# EAGLE design FeatherAzureSphere (EAGLE 8.0.2)
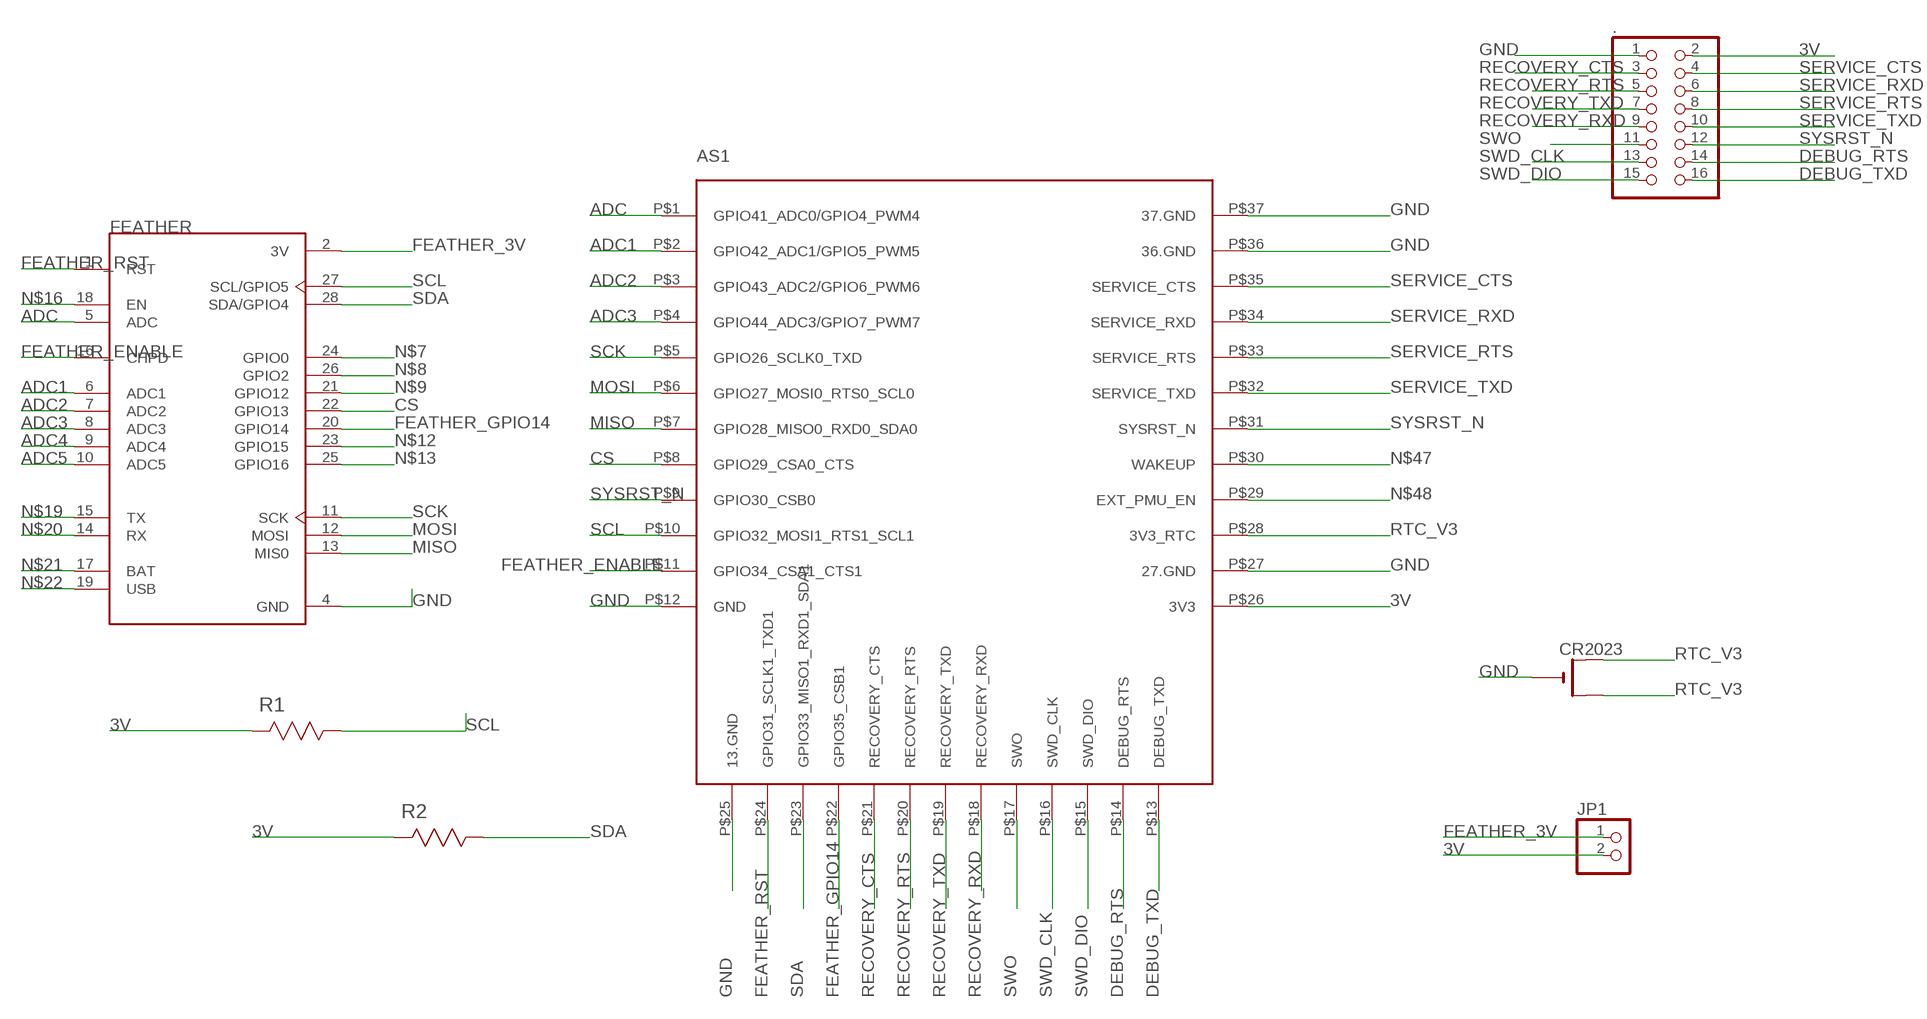
[diagram p0: schematic, sheet 1]

## Parts
.  PINHD-2X8  [2X08]
AS1  WF-M620-RSC1  [WF-M620-RSC1]
CR2023  CR2032SMT  [CR2032-SMD]
FEATHER  2821  [XCVR_2821]
JP1  PINHD-1X2  [1X02]
R1  ERJ-8RQF1R5V  [RESC3216X71N]
R2  ERJ-8RQF1R5V  [RESC3216X71N]

## Nets
3V: ..2 AS1.P$26(3V3) JP1.2 R1.2(R2) R2.2(R2)
ADC: AS1.P$1(GPIO41_ADC0/GPIO4_PWM4) FEATHER.5(ADC)
ADC1: AS1.P$2(GPIO42_ADC1/GPIO5_PWM5) FEATHER.6(ADC1)
ADC2: AS1.P$3(GPIO43_ADC2/GPIO6_PWM6) FEATHER.7(ADC2)
ADC3: AS1.P$4(GPIO44_ADC3/GPIO7_PWM7) FEATHER.8(ADC3)
ADC4: FEATHER.9(ADC4)
ADC5: FEATHER.10(ADC5)
CS: AS1.P$8(GPIO29_CSA0_CTS) FEATHER.22(GPIO13)
DEBUG_RTS: ..14 AS1.P$14(DEBUG_RTS)
DEBUG_TXD: ..16 AS1.P$13(DEBUG_TXD)
FEATHER_3V: FEATHER.2(3V) JP1.1
FEATHER_ENABLE: AS1.P$11(GPIO34_CSA1_CTS1) FEATHER.16(CHPD)
FEATHER_GPIO14: AS1.P$22(GPIO35_CSB1) FEATHER.20(GPIO14)
FEATHER_RST: AS1.P$24(GPIO31_SCLK1_TXD1) FEATHER.1(RST)
GND: ..1 AS1.P$12(GND) AS1.P$25(13.GND) AS1.P$27(27.GND) AS1.P$36(36.GND) AS1.P$37(37.GND) CR2023.- FEATHER.4(GND)
MISO: AS1.P$7(GPIO28_MISO0_RXD0_SDA0) FEATHER.13(MIS0)
MOSI: AS1.P$6(GPIO27_MOSI0_RTS0_SCL0) FEATHER.12(MOSI)
N$7: FEATHER.24(GPIO0)
N$8: FEATHER.26(GPIO2)
N$9: FEATHER.21(GPIO12)
N$12: FEATHER.23(GPIO15)
N$13: FEATHER.25(GPIO16)
N$16: FEATHER.18(EN)
N$19: FEATHER.15(TX)
N$20: FEATHER.14(RX)
N$21: FEATHER.17(BAT)
N$22: FEATHER.19(USB)
N$47: AS1.P$30(WAKEUP)
N$48: AS1.P$29(EXT_PMU_EN)
RECOVERY_CTS: ..3 AS1.P$21(RECOVERY_CTS)
RECOVERY_RTS: ..5 AS1.P$20(RECOVERY_RTS)
RECOVERY_RXD: ..9 AS1.P$18(RECOVERY_RXD)
RECOVERY_TXD: ..7 AS1.P$19(RECOVERY_TXD)
RTC_V3: AS1.P$28(3V3_RTC) CR2023.+$1(+) CR2023.+$2(+1)
SCK: AS1.P$5(GPIO26_SCLK0_TXD) FEATHER.11(SCK)
SCL: AS1.P$10(GPIO32_MOSI1_RTS1_SCL1) FEATHER.27(SCL/GPIO5) R1.1(R1)
SDA: AS1.P$23(GPIO33_MISO1_RXD1_SDA1) FEATHER.28(SDA/GPIO4) R2.1(R1)
SERVICE_CTS: ..4 AS1.P$35(SERVICE_CTS)
SERVICE_RTS: ..8 AS1.P$33(SERVICE_RTS)
SERVICE_RXD: ..6 AS1.P$34(SERVICE_RXD)
SERVICE_TXD: ..10 AS1.P$32(SERVICE_TXD)
SWD_CLK: ..13 AS1.P$16(SWD_CLK)
SWD_DIO: ..15 AS1.P$15(SWD_DIO)
SWO: ..11 AS1.P$17(SWO)
SYSRST_N: ..12 AS1.P$9(GPIO30_CSB0) AS1.P$31(SYSRST_N)

## Library data of the parts
. = pinhead:PINHD-2X8: PIN HEADER
AS1 = AzureSphere:WF-M620-RSC1
CR2023 = cr2032:CR2032
FEATHER = 2821:2821: Adafruit Feather HUZZAH with ESP8266 WiFi; AVAILABILITY: Unavailable; DESCRIPTION: Adafruit Feather HUZZAH with ESP8266 WiFi; MF: Adafruit Industries; MP: 2821; PACKAGE: None; PRICE: None
JP1 = pinhead:PINHD-1X2: PIN HEADER
R1 R2 = Panasonic_By_element14_Batch_1:ERJ-8RQF1R5V: RESISTOR, 1206; MPN: ERJ-8RQF1R5V; OC_FARNELL: 1717854; OC_NEWARK: 15R1531; SUPPLIER: Panasonic; TOLERANCE: ±1 %; VALUE: 1.5 Ohm; WATTAGE: 0.25 W

## Board
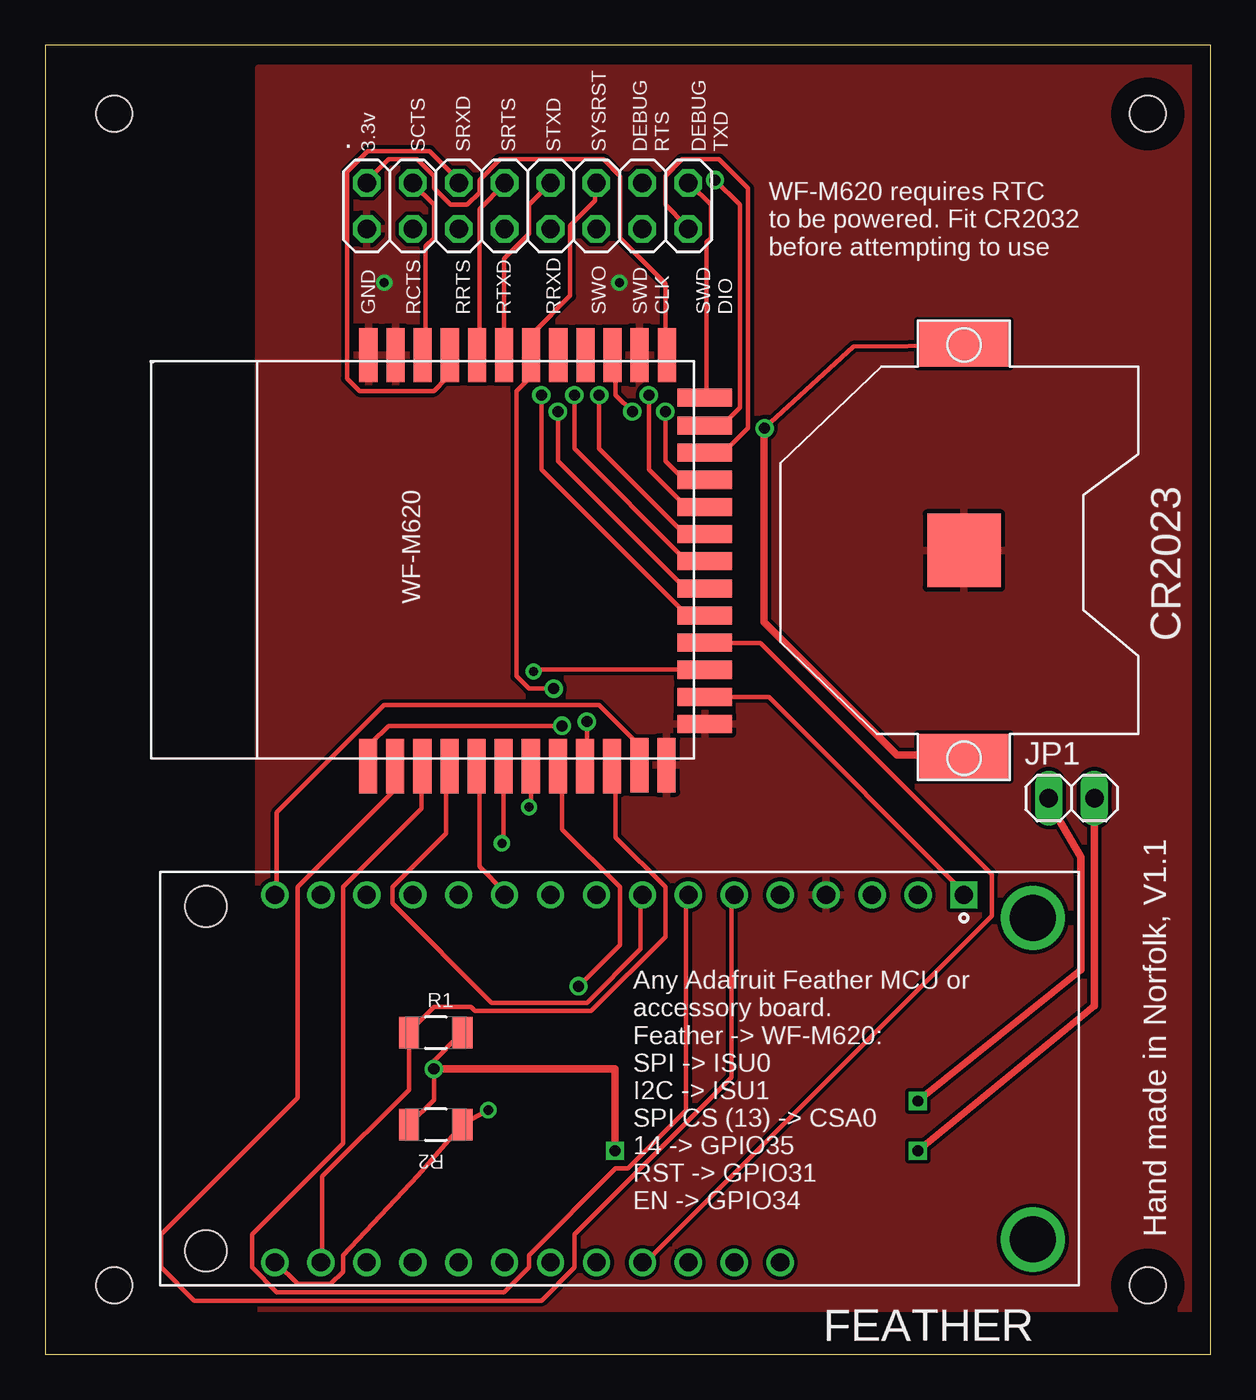
[diagram p1: board, top side]
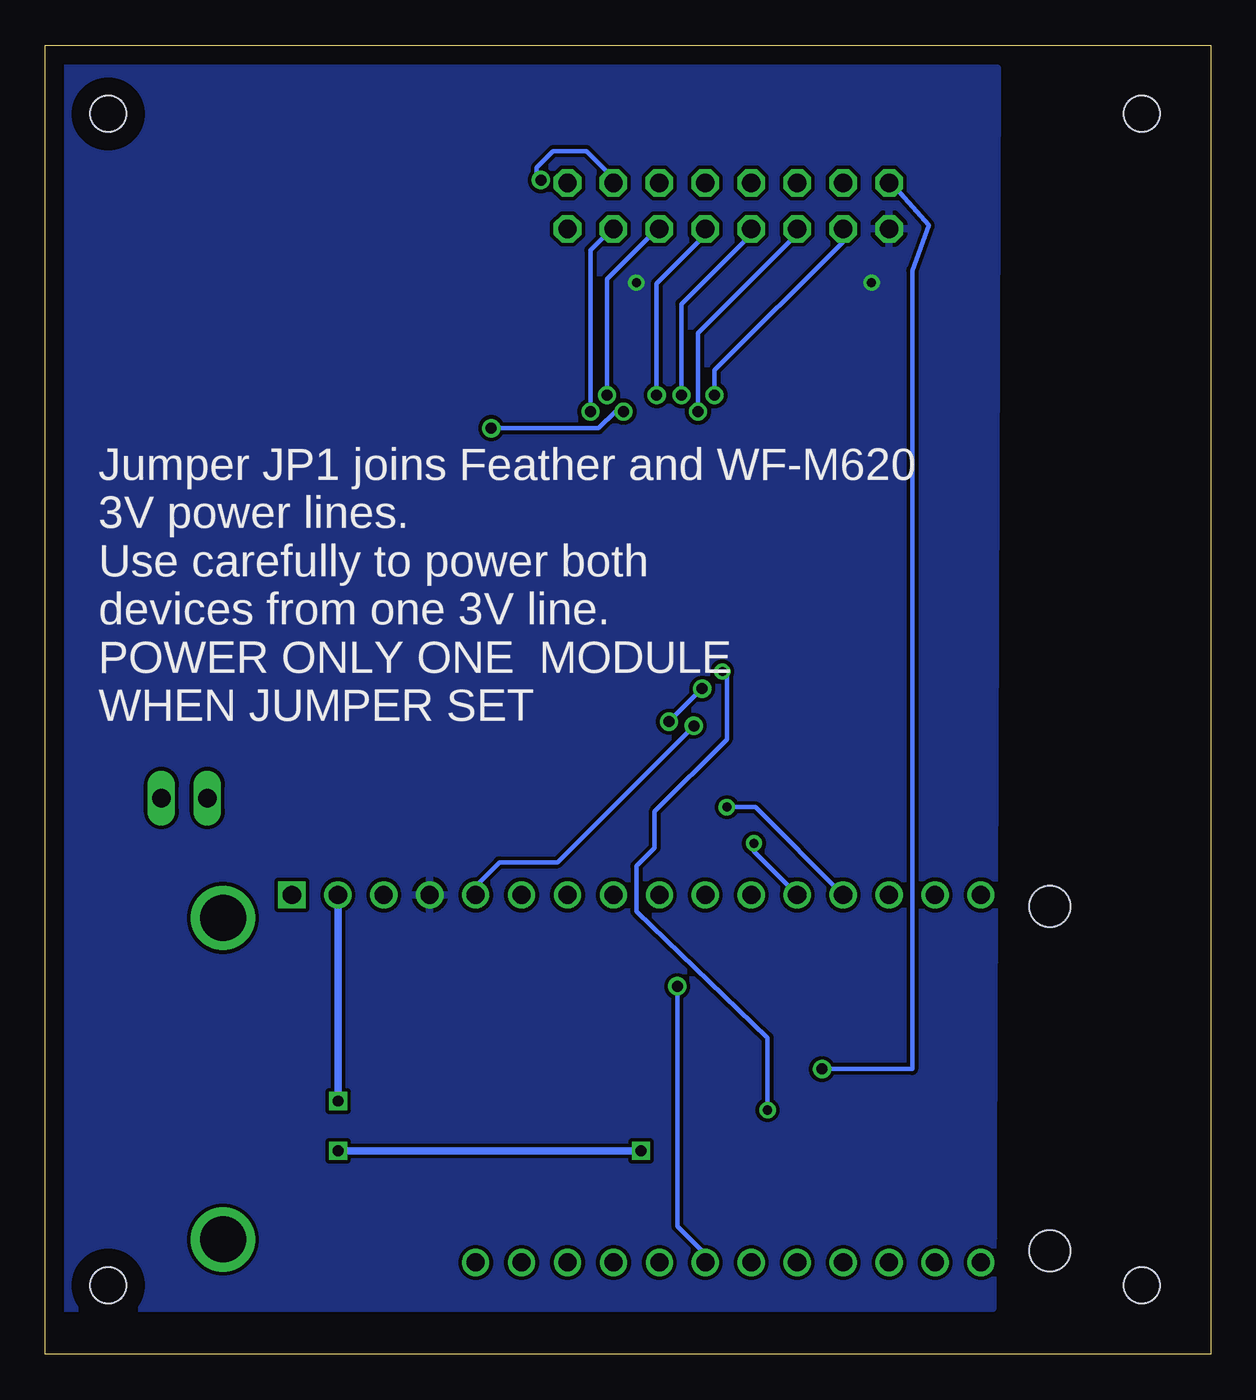
[diagram p2: board, bottom side, seen from below]

Size 64.44 x 72.38 mm. Coordinates in mm from the lower left corner, seen from the top.
Outline: 0,0 64.44,0 64.44,72.38 0,72.38 0,0
Copper layers (1*16): Top 0.035mm / dielectric 1.5mm / Bottom 0.035mm
Design rules "default": minimum track width 10mil, minimum drill 24mil, track to track 8mil, track to pad 8mil, pad to pad 8mil, via to via 8mil, smd to smd 8mil, copper to edge 40mil, drill to drill 8mil, minimum pad ring 10mil, minimum via ring 8mil, stop-mask expansion 4mil, vias tented up to drill 0mil, thermal gap 10mil
Holes 2 mm at 3.81,68.58 3.81,3.81 60.96,68.58 60.96,3.81

### Footprints (pad centres in the part's own frame; a part is rotated, then mirrored left to right if it is on the bottom)
2X08 = drill 1.016 octagon: 1 -8.89,-1.27; 2 -8.89,1.27; 3 -6.35,-1.27; 4 -6.35,1.27; 5 -3.81,-1.27; 6 -3.81,1.27; 7 -1.27,-1.27; 8 -1.27,1.27; 9 1.27,-1.27; 10 1.27,1.27; 11 3.81,-1.27; 12 3.81,1.27; 13 6.35,-1.27; 14 6.35,1.27; 15 8.89,-1.27; 16 8.89,1.27
WF-M620-RSC1 = smd 3 x 1: P$1 -11.93,-3.88; P$2 -11.93,-5.38; P$3 -11.93,-6.88; P$4 -11.93,-8.38; P$5 -11.93,-9.88; P$6 -11.93,-11.38; P$7 -11.93,-12.88; P$8 -11.93,-14.38; P$9 -11.93,-15.88; P$10 -11.93,-17.38; P$11 -11.88,-18.88; P$12 -11.88,-20.38; P$26 10.8,-20.4; P$27 10.8,-18.9; P$28 10.8,-17.4; P$29 10.8,-15.9; P$30 10.8,-14.4; P$31 10.8,-12.9; P$32 10.8,-11.4; P$33 10.8,-9.9; P$34 10.8,-8.4; P$35 10.8,-6.9; P$36 10.8,-5.4; P$37 10.8,-3.9 | smd 1 x 3: P$13 8.45,-22.5; P$14 6.9,-22.5; P$15 5.4,-22.5; P$16 3.9,-22.5; P$17 2.4,-22.5; P$18 0.9,-22.5; P$19 -0.6,-22.5; P$20 -2.1,-22.5; P$21 -3.6,-22.5; P$22 -5.1,-22.5; P$23 -6.6,-22.5; P$24 -8.1,-22.5; P$25 -9.6,-22.5
CR2032-SMD = smd 2.54 x 5.08: +$1 -11.43,0; +$2 11.43,0 | smd 4.064 x 4.064: - 0,0
XCVR_2821 = drill 1 square: 1 -19.05,-10.16 | drill 1: 2 -16.51,-10.16; 3 -13.97,-10.16; 4 -11.43,-10.16; 5 -8.89,-10.16; 6 -6.35,-10.16; 7 -3.81,-10.16; 8 -1.27,-10.16; 9 1.27,-10.16; 10 3.81,-10.16; 11 6.35,-10.16; 12 8.89,-10.16; 13 11.43,-10.16; 14 13.97,-10.16; 15 16.51,-10.16; 16 19.05,-10.16; 17 -8.89,10.16; 18 -6.35,10.16; 19 -3.81,10.16; 20 -1.27,10.16; 21 1.27,10.16; 22 3.81,10.16; 23 6.35,10.16; 24 8.89,10.16; 25 11.43,10.16; 26 13.97,10.16; 27 16.51,10.16; 28 19.05,10.16 | drill 2.54: S1 -22.86,-8.89; S2 -22.86,8.89 | hole 2.286: 22.86,-9.525; 22.86,9.525
1X02 = drill 1.016 long: 1 -1.27,0; 2 1.27,0
RESC3216X71N = smd 1.118 x 1.753: 1 -1.473,0; 2 1.473,0

### Placement (x,y rotation side)
.  26.67,63.5 0 top
AS1  13.97,44.45 90 top
CR2023  50.8,44.45 270 top
FEATHER  31.75,15.24 180 top
JP1  56.75,30.75 0 top
R1  21.59,17.78 0 top
R2  21.59,12.7 180 top

### Tracks (layer width: path | path; a pad name or v marks a point on that pad's centre or on a via)
3V  (via drill 0.6, 0.61)
  Top 0.254: R1.2 22.86,17.6 21.49,16.23 v21.49,15.77 21.49,14.07 R2.2 | AS1.P$26 34.29,55.32 34.29,59.21 31.77,61.72 31.77,65.15 30.86,66.06 25.15,66.06 24,64.92 24,64.24 23.32,63.55 22.4,63.55 21.49,64.47 21.49,65.15 20.57,66.06 18.97,66.06 17.83,64.92 ..2
  Top 0.406: v21.49,15.77 31.5,15.77 v31.5,11.25 | JP1.2 58.02,19.25 v48.25,11.25
  Bottom 0.254: v21.49,15.77 16.5,15.77 16.5,59.92 15.58,62.42 17.6,64.69 ..2
  Bottom 0.406: v31.5,11.25 v48.25,11.25
ADC  (via drill 0.61)
  Top 0.254: v28.57,34.75 18.97,34.75 18.06,33.83 18.06,32.69 AS1.P$1
  Bottom 0.254: v28.57,34.75 36.12,27.2 39.32,27.2 40.46,26.06 40.46,25.6 FEATHER.5
ADC1
  Top 0.254: AS1.P$2 19.2,32.46 19.2,31.09 13.95,25.83 13.95,14.17 6.4,6.63 6.4,4.8 8.23,2.97 27.43,2.97 29.26,4.8 29.26,6.63 37.95,15.32 37.95,25.38 FEATHER.6
ADC2
  Top 0.254: AS1.P$3 20.8,32.46 20.8,30.18 16.46,25.83 16.46,11.66 11.43,6.63 11.43,4.8 12.8,3.43 25.38,3.43 26.75,4.8 26.75,5.49 31.55,10.29 32.23,10.29 35.43,13.49 35.43,25.38 FEATHER.7
ADC3
  Top 0.254: AS1.P$4 22.17,32.46 22.17,28.8 19.2,25.83 19.2,24.92 24.69,19.43 29.95,19.43 32.92,22.4 32.92,25.38 FEATHER.8
CS  (via drill 0.61)
  Top 0.254: v29.49,20.34 31.77,22.63 31.77,25.83 28.57,29.03 28.57,32.46 AS1.P$8
  Bottom 0.254: v29.49,20.34 29.49,7.09 28.12,5.71 28.12,5.26 FEATHER.22
DEBUG_RTS  (via drill 0.61)
  Top 0.254: v37.03,64.92 38.41,63.55 38.41,52.35 37.49,51.44 36.58,51.44 AS1.P$14
  Bottom 0.254: v37.03,64.92 37.26,65.15 37.26,65.61 36.35,66.52 34.52,66.52 32.92,64.92 ..14
DEBUG_TXD
  Top 0.254: AS1.P$13 36.58,53.03 36.58,61.49 36.8,61.72 36.8,63.55 35.66,64.69 ..16
FEATHER_3V  (via drill 0.6)
  Top 0.254: JP1.1 55.55,30.63 55.48,30.5
  Top 0.406: 55.48,30.5 57.25,27.5 57.25,21.25 v48.25,14
  Bottom 0.406: FEATHER.2 v48.25,14
FEATHER_ENABLE
  Top 0.254: AS1.P$11 32.69,32.69 32.69,33.83 30.63,35.89 18.75,35.89 12.8,29.95 12.8,25.6 FEATHER.16
FEATHER_GPIO14
  Top 0.254: AS1.P$22 36.58,39.32 39.55,39.32 52.35,26.52 52.35,24.23 33.15,5.03 FEATHER.20
FEATHER_RST
  Top 0.254: AS1.P$24 36.58,36.35 40.01,36.35 50.75,25.6 FEATHER.1
GND  (via drill 0.5)
  other vias: 31.75,59.25 18.75,59.25
  pour Top: 11.79,71.12 63.5,71.12 63.5,2.54 11.79,2.54
  pour Bottom: 11.79,71.12 63.5,71.12 63.5,2.54 12.04,2.54
MISO  (via drill 0.5)
  Top 0.254: AS1.P$7 26.85,30.6 v26.75,30.25
  Bottom 0.254: v26.75,30.25 25.17,30.25 FEATHER.13
MOSI  (via drill 0.5)
  Top 0.254: AS1.P$6 25.35,28.35 v25.25,28.25
  Bottom 0.254: v25.25,28.25 25.25,27.79 FEATHER.12
RECOVERY_CTS  (via drill 0.61)
  Top 0.254: v27.43,53.03 27.43,48.92 35.43,40.92 36.35,40.92 AS1.P$21
  Bottom 0.254: v27.43,53.03 27.43,54.41 20.34,61.49 20.34,62.18 ..3
RECOVERY_RTS  (via drill 0.61)
  Top 0.254: v28.35,52.12 28.35,49.38 35.2,42.52 36.35,42.52 AS1.P$20
  Bottom 0.254: v28.35,52.12 28.35,56.46 22.86,61.95 ..5
RECOVERY_RXD  (via drill 0.61)
  Top 0.254: v30.63,53.03 30.63,50.06 35.2,45.49 36.35,45.49 AS1.P$18
  Bottom 0.254: v30.63,53.03 30.63,59.21 28.12,61.72 28.12,62.18 ..9
RECOVERY_TXD  (via drill 0.61)
  Top 0.254: v29.26,53.03 29.26,50.06 35.43,43.89 36.35,43.89 AS1.P$19
  Bottom 0.254: v29.26,53.03 29.26,58.06 25.6,61.72 25.6,62.18 ..7
RTC_V3  (via drill 0.61)
  Top 0.254: v32.46,52.12 31.55,53.03 31.55,55.09 AS1.P$28 | v39.78,51.21 44.68,55.71 50.75,55.78 CR2023.+$1 | CR2023.+$2 50.75,33.15
  Top 0.406: 50.75,33.15 47.1,33.15 39.75,40.5 39.75,51.21 v39.78,51.21
  Bottom 0.254: v32.46,52.12 32.92,52.12 33.83,51.21 v39.78,51.21
SCK
  Top 0.254: AS1.P$5 24,32.46 24,26.98 25.38,25.6 FEATHER.11
SCL
  Top 0.254: FEATHER.27 15.32,5.26 15.32,9.83 20.12,14.63 R1.1 20.12,17.83 21.49,19.2 23.55,19.2 23.77,18.97 30.18,18.97 34.29,23.09 34.29,25.83 31.55,28.57 31.55,32.46 AS1.P$10
SDA  (via drill 0.5)
  Top 0.254: FEATHER.28 12.8,5.03 13.95,3.89 15.77,3.89 16.46,4.57 16.46,5.49 20.62,9.89 R2.1 23.06,12.75 v24.5,13.5 | AS1.P$23 27,37.85 v27,37.75
  Bottom 0.254: v27,37.75 26.75,37.75 26.75,34 30.75,30 30.75,28 31.75,27 31.75,24.5 24.5,17.5 v24.5,13.5
SERVICE_CTS
  Top 0.254: AS1.P$35 21.03,55.32 21.03,61.27 21.49,61.72 21.49,63.55 20.34,64.69 ..4
SERVICE_RTS
  Top 0.254: AS1.P$33 24,55.32 24,63.32 25.38,64.69 ..8
SERVICE_RXD
  Top 0.254: AS1.P$34 22.17,55.09 22.17,53.95 21.49,53.26 17.37,53.26 16.69,53.95 16.69,65.38 17.83,66.52 21.26,66.52 22.86,64.92 ..6
SERVICE_TXD
  Top 0.254: AS1.P$32 25.38,55.32 25.38,60.58 26.75,61.95 26.75,63.55 27.89,64.69 ..10
SWD_CLK  (via drill 0.61)
  Top 0.254: v34.29,52.12 34.29,49.38 35.2,48.46 36.35,48.46 AS1.P$16
  Bottom 0.254: v34.29,52.12 34.29,61.04 33.15,62.18 ..13
SWD_DIO
  Top 0.254: AS1.P$15 36.58,50.06 37.72,50.06 38.86,51.21 38.86,64.47 37.26,66.06 35.2,66.06 34.29,65.15 34.29,63.55 35.43,62.41 ..15
SWO  (via drill 0.61)
  Top 0.254: v33.38,53.03 33.38,48.92 35.43,46.86 36.35,46.86 AS1.P$17
  Bottom 0.254: v33.38,53.03 33.38,59.44 30.63,62.18 ..11
SYSRST_N  (via drill 0.61)
  Top 0.254: ..12 30.4,64.69 30.4,63.78 29.03,62.41 29.03,58.52 26.98,56.46 26.98,55.32 AS1.P$31 26.75,55.09 26.75,53.95 26.06,53.26 26.06,37.49 26.75,36.8 v28.12,36.8 | v29.95,34.98 29.95,32.69 AS1.P$9
  Bottom 0.254: v28.12,36.8 v29.95,34.98

### Text on the board
tNames: 3.3v | SCTS | SRXD | SRTS | STXD | SYSRST | DEBUG / RTS | DEBUG / TXD | WF-M620 requires RTC / to be powered. Fit CR2032 / before attempting to use | GND | RCTS | RRTS | RTXD | RRXD | SWO | SWD / CLK | SWD / DIO | WF-M620 | Any Adafruit Feather MCU or / accessory board. / Feather -> WF-M620: / SPI -> ISU0 / I2C -> ISU1 / SPI CS (13) -> CSA0 / 14 -> GPIO35 / RST -> GPIO31 / EN -> GPIO34 | Hand made in Norfolk, V1.1
bNames: Jumper JP1 joins Feather and WF-M620 / 3V power lines. / Use carefully to power both / devices from one 3V line. / POWER ONLY ONE MODULE / WHEN JUMPER SET